# EAGLE schematic ATtiny4313_PCA9543_Test (EAGLE 6.5.0)
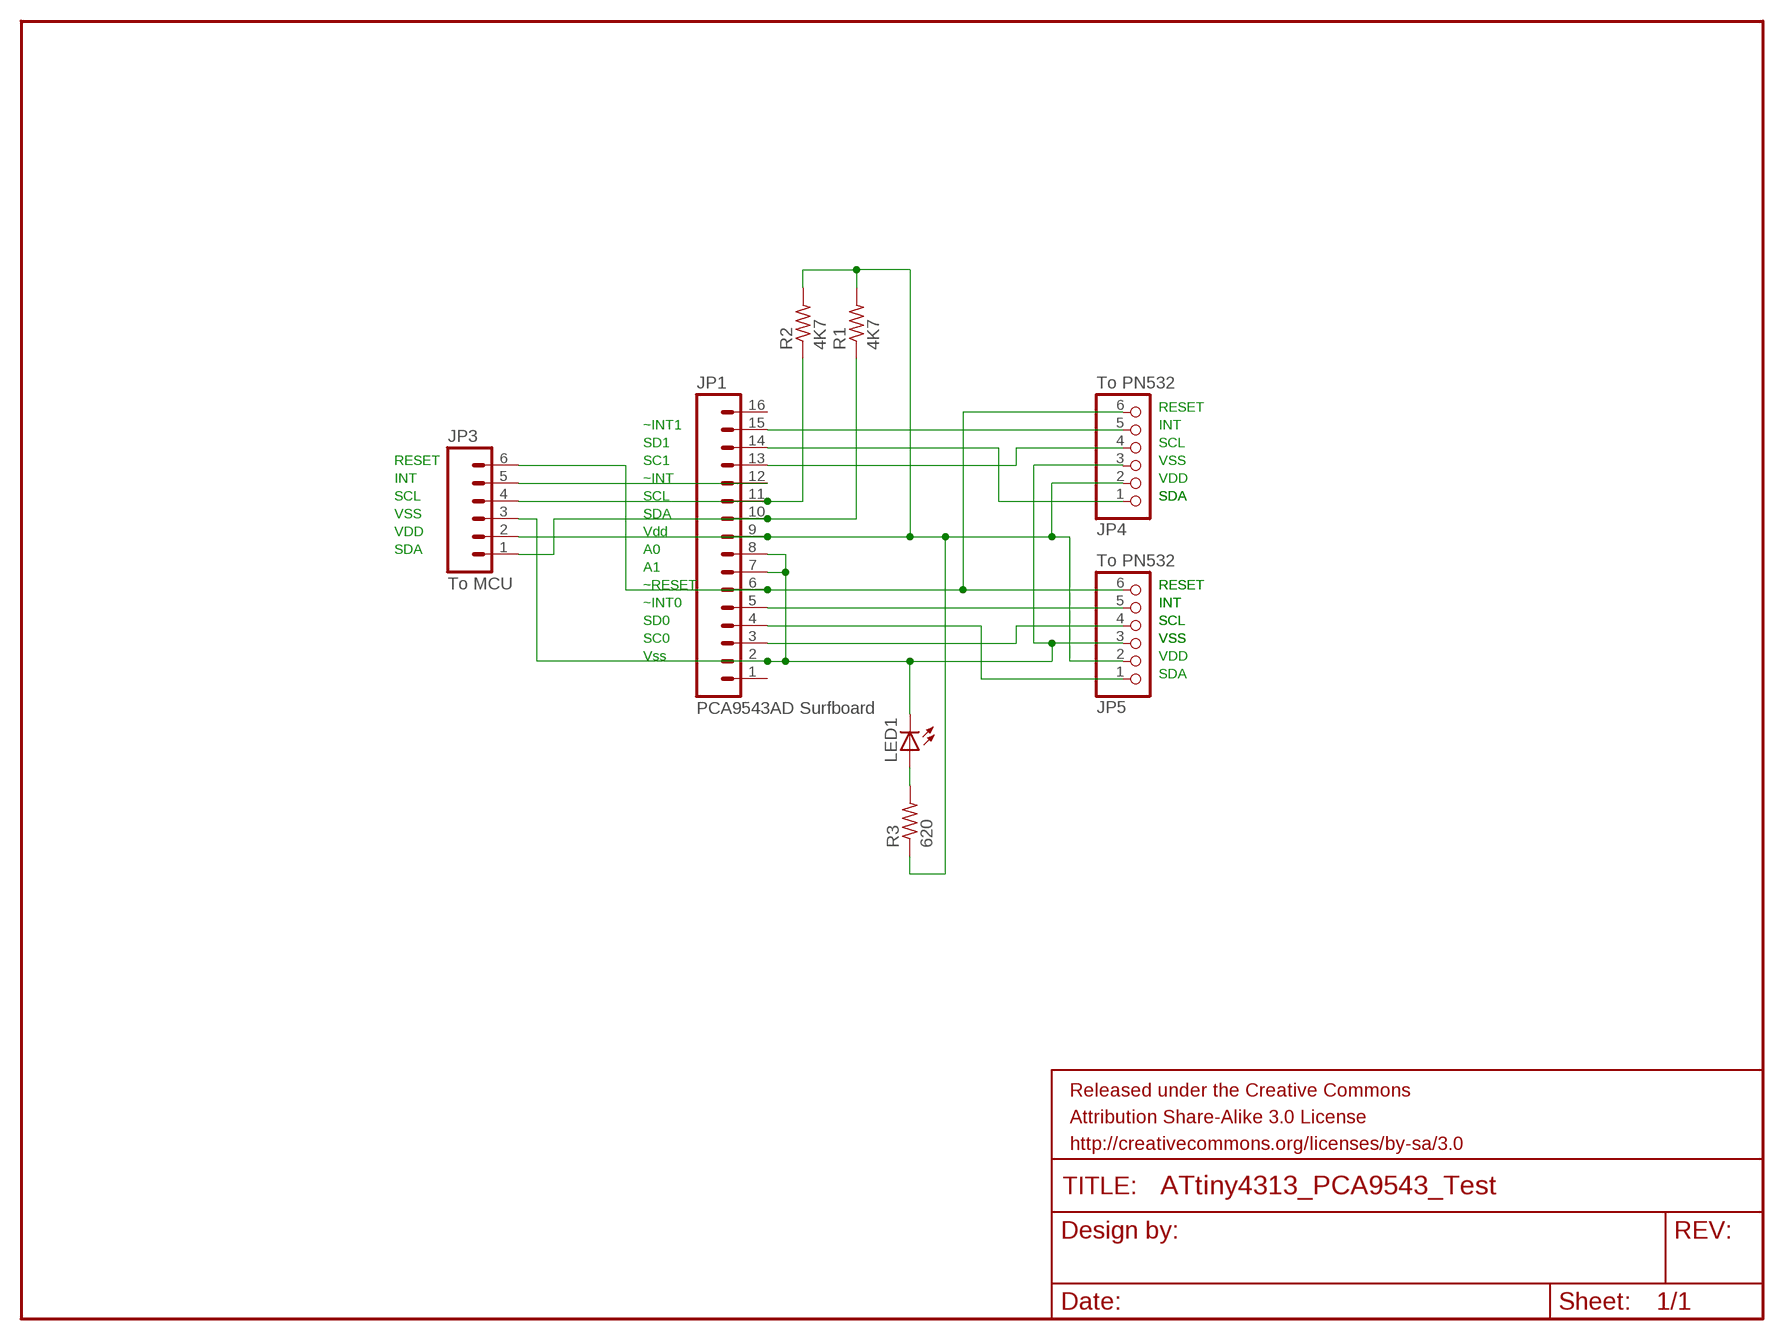
[diagram p0: schematic, sheet 1]

## Parts
JP1  PCA9543AD Surfboard  M16MACHIINE-PIN_LOCK  [1X16_MACHINE-PIN-HEADER_LOCK.004]
JP3  To MCU  M06LONGPADS  [1X06_LONGPADS]
JP4  To PN532  PINHD-1X6/90  [1X06/90]
JP5  To PN532  PINHD-1X6/90  [1X06/90]
LED1  LED5MM  [LED5MM]
R1  4K7  R-US_0204/5  [0204/5]
R2  4K7  R-US_0204/5  [0204/5]
R3  620  R-US_0309/12  [0309/12]

## Nets
N$1: JP1.11 JP3.4 R2.1
N$3: JP1.10 JP3.1 R1.1
N$4: JP1.13 JP4.4
N$5: JP1.12 JP3.5
N$6: JP1.6 JP3.6 JP4.6 JP5.6
N$7: JP1.14 JP4.1
N$8: JP1.15 JP4.5
N$9: JP1.3 JP5.4
N$10: JP1.4 JP5.1
N$11: JP1.5 JP5.5
N$12: LED1.A R3.2
N$13: JP1.2 JP1.7 JP1.8 JP3.3 JP4.3 JP5.3 LED1.K(C)
N$14: JP1.9 JP3.2 JP4.2 JP5.2 R1.2 R2.2 R3.1
Unconnected: JP1.1 JP1.16

## Notes on the sheet
- RESET
- ~INT1 | INT
- SD1 | SCL
- RESET | SC1 | VSS
- INT | ~INT | VDD
- SCL | SCL | SDA | SDA
- VSS | SDA
- VDD | Vdd
- SDA | A0
- A1
- ~RESET | RESET | RESET
- ~INT0 | INT | INT
- SD0 | SCL | SCL
- SC0 | VSS | VSS
- Vss | VDD
- SDA

## Library data of the parts
JP1 = SparkFun-Connectors:M16: 1x16 .1" header
JP3 = SparkFun-Connectors:M06: Header 6 Standard 6-pin 0.1" header. Use with straight break away headers (SKU : PRT-00116), right angle break away headers (PRT-00553), swiss pins (PRT-00743), machine pins (PRT-00117), and female headers (PRT-00115). Molex polarized connector foot print use with SKU : PRT-08094 with associated crimp pins and housings. NOTES ON THE VARIANTS LOCK and LOCK_LONGPADS... This footprint was designed to help hold the alignment of a through-hole component (i.e. 6-pin header) while soldering it into place. You may notice that each hole has been shifted either up or down by 0.005 of an inch from it's more standard position (which is a perfectly straight line). This slight alteration caused the pins (the squares in the middle) to touch the edges of the holes. Because they are alternating, it causes a "brace" to hold the component in place. 0.005 has proven to be the perfect amount of "off-center" position when using our standard breakaway headers. Although looks a little odd when you look at the bare footprint, once you have a header in there, the alteration is very hard to notice. Also, if you push a header all the way into place, it is covered up entirely on the bottom side. This idea of altering the position of holes to aid alignment will be further integrated into the Sparkfun Library for other footprints. It can help hold any component with 3 or more connection pins.
JP4 JP5 = pinhead:PINHD-1X6: PIN HEADER
LED1 = adafruit:LED: LED OSRAM: - CHIPLED LG R971, LG N971, LY N971, LG Q971, LY Q971, LO R971, LY R971 LH N974, LH R974 LS Q976, LO Q976, LY Q976 LO Q996 - Hyper CHIPLED LW Q18S LB Q993, LB Q99A, LB R99A - SideLED LS A670, LO A670, LY A670, LG A670, LP A670 LB A673, LV A673, LT A673, LW A673 LH A674 LY A675 LS A676, LA A676, LO A676, LY A676, LW A676 LS A679, LY A679, LG A679 - Hyper Micro SIDELED® LS Y876, LA Y876, LO Y876, LY Y876 LT Y87S - SmartLED LW L88C, LW L88S LB L89C, LB L89S, LG L890 LS L89K, LO L89K, LY L89K LS L896, LA L896, LO L896, LY L896 - TOPLED LS T670, LO T670, LY T670, LG T670, LP T670 LSG T670, LSP T670, LSY T670, LOP T670, LYG T670 LG T671, LOG T671, LSG T671 LB T673, LV T673, LT T673, LW T673 LH T674 LS T676, LA T676, LO T676, LY T676, LB T676, LH T676, LSB T676, LW T676 LB T67C, LV T67C, LT T67C, LS T67K, LO T67K, LY T67K, LW E67C LS E67B, LA E67B, LO E67B, LY E67B, LB E67C, LV E67C, LT E67C LW T67C LS T679, LY T679, LG T679 LS T770, LO T770, LY T770, LG T770, LP T770 LB T773, LV T773, LT T773, LW T773 LH T774 LS E675, LA E675, LY E675, LS T675 LS T776, LA T776, LO T776, LY T776, LB T776 LHGB T686 LT T68C, LB T68C - Hyper Mini TOPLED® LB M676 - Mini TOPLED Santana® LG M470 LS M47K, LO M47K, LY M47K Source: http://www.osram.convergy.de/
R1-R3 = adafruit:R-US_: RESISTOR, American symbol